# Altium schematic sheet [12]-WIFI Module WF60.SchDoc: RK3399 SOM Board Design V1.0
size A4; Author: AVIRAL MISHRA; DocumentNumber: 14; SheetNumber: 14; SheetTotal: 21; PROJECT CODE: A_V1.0
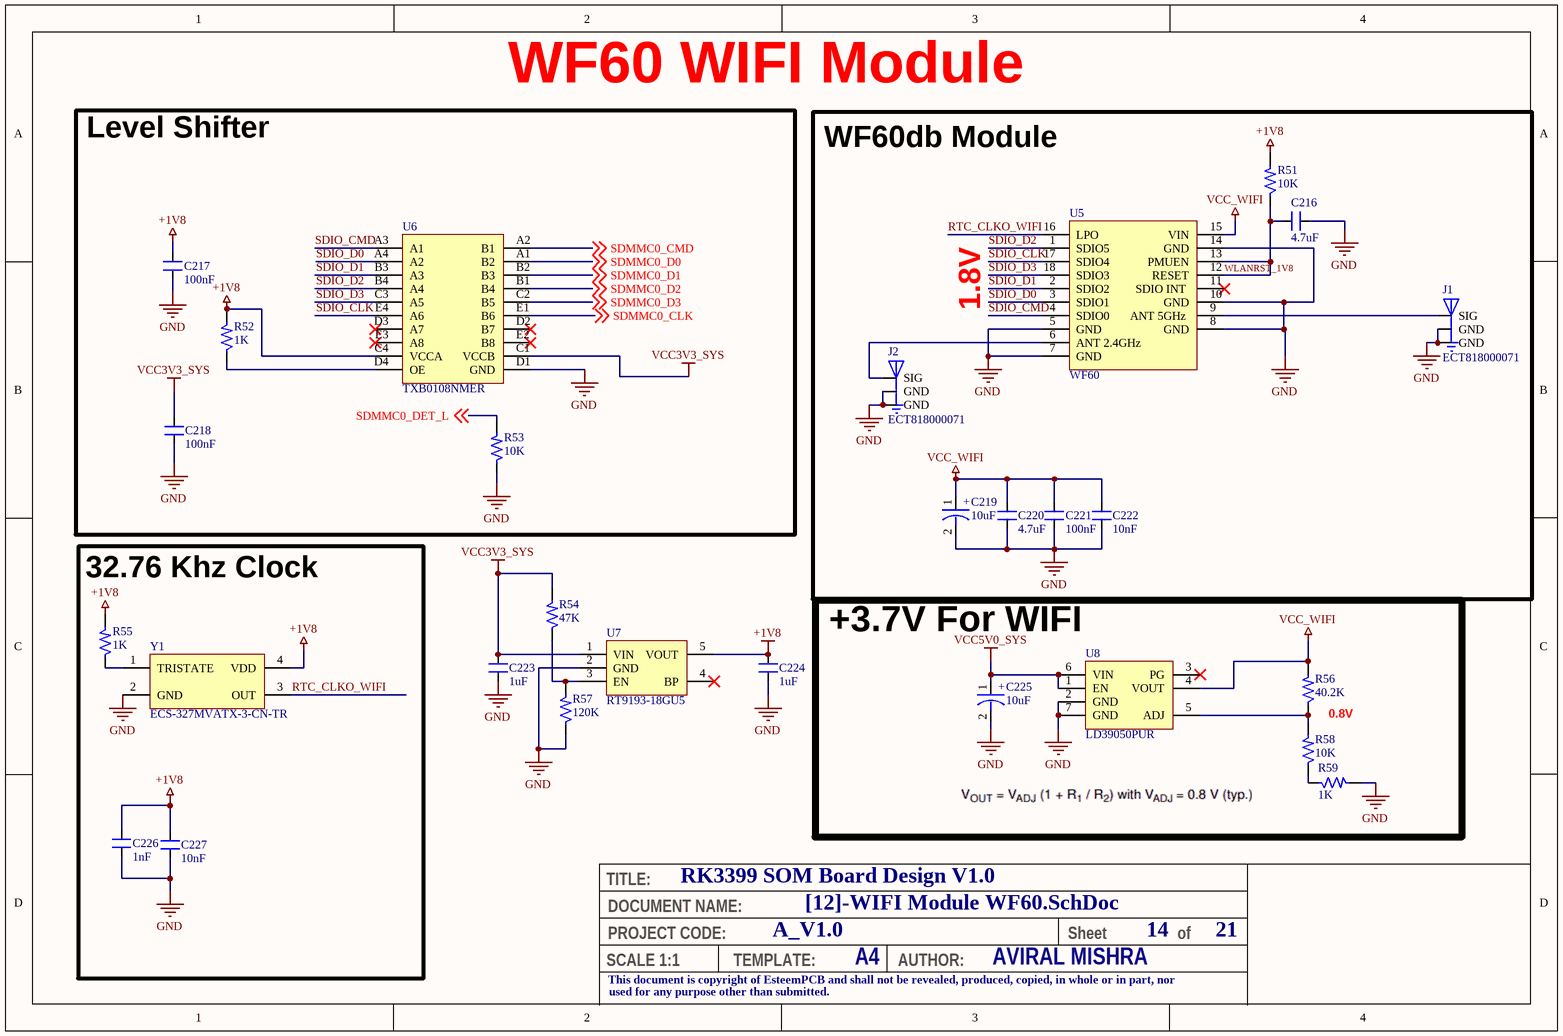
[diagram p0: [12]-WIFI Module WF60.SchDoc]

## Parts
C216  4.7uF  [CAP_0402]
C217  100nF  [CAP_0402]
C218  100nF  [CAP_0402]
C219  10uF  [CAP-T_1206]
C220  4.7uF  [CAP_0402]
C221  100nF  [CAP_0402]
C222  10nF  [CAP_0402]
C223  1uF  [CAP_0402]
C224  1uF  [CAP_0402]
C225  10uF  [CAP-T_1206]
C226  1nF  [CAP_0402]
C227  10nF  [CAP_0402]
J1  ECT818000071  [CON3_UFL_116_SMD_ST]
J2  ECT818000071  [CON3_UFL_116_SMD_ST]
R51  10K  [RES_0402]
R52  1K  [RES_0402]
R53  10K  [RES_0402]
R54  47K  [RES_0402]
R55  1K  [RES_0402]
R56  40.2K  [RES_0805]
R57  120K  [RES_0402]
R58  10K  [RES_0402]
R59  1K  [RES_0402]
U5  WF60  [MOD_WF60]
U6  TXB0108NMER  [NFBGA_31.4_125.9X102.36]
U7  RT9193-18GU5  [SC70-5]
U8  LD39050PUR  [DFN-6_37.4_165_33X15_SMD]
Y1  ECS-327MVATX-3-CN-TR  [XTAL_57_35X31_SMD]

## Blocks framed on the sheet
WF60 WIFI Module: C217 C218 R52 R53 U6
32.76 Khz Clock: C226 C227 R55 Y1
+3.7V For WIFI: C225 R56 R58 R59 U8

## Nets
+1V8: C217.2 C224.2 C226.2 C227.2 R51.2 R52.2 R55.2 U6.C4(VCCA) U7.5(VOUT) Y1.4(VDD)
GND: C216.1 C217.1 C218.1 C219.2 C220.1 C221.1 C222.1 C223.1 C224.1 C225.2 C226.1 C227.1 J1.1(GND) J1.3(GND) J2.1(GND) J2.3(GND) R53.1 R57.1 R59.2 U5.5(GND) U5.7(GND) U5.8(GND) U5.10(GND) U5.14(GND) U6.D1(GND) U7.2(GND) U8.2(GND) U8.7(GND) Y1.2(GND)
VCC3V3_SYS: C218.2 C223.2 R54.2 U6.C1(VCCB) U7.1(VIN)
VCC5V0_SYS: C225.1 U8.1(EN) U8.6(VIN)
VCC_WIFI: C219.1 C220.2 C221.2 C222.2 R56.2 U5.15(VIN) U8.4(VOUT)
RTC_CLKO_WIFI: U5.16(LPO) Y1.3(OUT)
SDIO_CLK: U5.17(SDIO4) U6.E4(A6)
SDIO_CMD: U5.4(SDIO0) U6.A3(A1)
SDIO_D0: U5.3(SDIO1) U6.A4(A2)
SDIO_D1: U5.2(SDIO2) U6.B3(A3)
SDIO_D2: U5.1(SDIO5) U6.B4(A4)
SDIO_D3: U5.18(SDIO3) U6.C3(A5)
SDMMC0_CLK: U6.E1(B6) ; off-sheet SDMMC0_CLK
SDMMC0_CMD: U6.A2(B1) ; off-sheet SDMMC0_CMD
SDMMC0_D0: U6.A1(B2) ; off-sheet SDMMC0_D0
SDMMC0_D1: U6.B2(B3) ; off-sheet SDMMC0_D1
SDMMC0_D2: U6.B1(B4) ; off-sheet SDMMC0_D2
SDMMC0_D3: U6.C2(B5) ; off-sheet SDMMC0_D3
SDMMC0_DET_L: R53.2 ; off-sheet SDMMC0_DET_L
WLANRST_1V8: C216.2 R51.1 U5.12(RESET) U5.13(PMUEN)
NetJ1_2: J1.2(SIG) U5.9(ANT_5GHz)
NetJ2_2: J2.2(SIG) U5.6(ANT_2.4GHz)
NetR52_1: R52.1 U6.D4(OE)
NetR54_1: R54.1 R57.2 U7.3(EN)
NetR55_1: R55.1 Y1.1(TRISTATE)
NetR56_1: R56.1 R58.2 U8.5(ADJ)
NetR58_1: R58.1 R59.1

Not connected (* = marked no-connect by the designer): U5 11(SDIO_INT_)*; U6 D2(B7)* D3(A7)* E2(B8)* E3(A8)*; U7 4(BP)*; U8 3(PG)*

## Notes on the sheet
- Level Shifter
- WF60db Module
- 1.8V
- 0.8V
- TITLE:
- DOCUMENT NAME:
- SCALE 1:1
- This document is copyright of EsteemPCB and shall not be revealed, produced, copied, in whole or in part, nor
- PROJECT CODE:
- TEMPLATE:
- A4
- AUTHOR:
- Sheet
- of
- used for any purpose other than submitted.
- (in symbol CAP-P_10uF-16V-10%-1206) +

## Library data of the parts
C216 C220 = CAP_4.7uF-10V-10%-0402: 4.7µF ±10% 10V Ceramic Capacitor X5R 0402 (1005 Metric) /; Manufacturer: Samsung Electro-Mechanics; Manufacturer Part Number: CL05A475KP5NRNC; Case/Package: 0402; Supplier-1: Digikey
C217 C218 C221 = CAP_100nF-25V-10%-0402: 0.1µF ±10% 25V Ceramic Capacitor X7R 0402 (1005 Metric) /; Manufacturer: Walsin Technology Corporation; Manufacturer Part Number: 0402B104K250CT; Case/Package: 0402; Supplier-1: Digikey
C219 C225 = CAP-P_10uF-16V-10%-1206: 10µF Molded Tantalum Capacitors 16V 1206 (3216 Metric) 3Ohm /; Manufacturer: AVX Corporation; Manufacturer Part Number: TAJA106K016SNJ; Nymble Part Number: 1EA-AA-0003; Alternate Part Number-1: CA45-A016K106T; Case/Package: 1206; Supplier-1: SIRICOM; Supplier Part Number-1: TAJA106K016SNJ; Category: Capacitor; Number of Pins: 2
C222 C227 = CAP_10nF-10V-10%-0402: 10000pF ±10% 10V Ceramic Capacitor X7R 0402 (1005 Metric) /; Manufacturer: AVX Corporation; Manufacturer Part Number: 0402ZC103KAT2A; Case/Package: 0402; Supplier-1: Digikey
C223 C224 = CAP_1uF-16V-10%-0402: 1µF ±10% 16V Ceramic Capacitor X5R 0402 (1005 Metric) /; Manufacturer: Knowles Novacap; Manufacturer Part Number: 0402BW105K160YT; Case/Package: 0402; Supplier-1: Digikey
C226 = CAP_1nF-16V-10%-0402: 1000pF ±10% 16V Ceramic Capacitor X7R 0402 (1005 Metric) /; Manufacturer: Yageo; Manufacturer Part Number: CC0402KRX7R7BB102; Case/Package: 0402; Supplier-1: Digikey
J1 J2 = CON-PLG_3X1-ECT818000071-ST-SMD: SMD RF Connectors/Coaxial Connectors RoHS; Manufacturer: ECT; Manufacturer Part Number: ECT818000071; Case/Package: SMD; Supplier-1: LCSC
R51 R53 R58 = RES_10K-0.1W-1%-0402: 10 kOhms ±1% 0.1W, 1/10W Chip Resistor 0402 (1005 Metric) Anti-Sulfur Thin Film /; Manufacturer: Vishay Beyschlag/Draloric/BC Components; Manufacturer Part Number: MCS04020C1002FE000; Case/Package: 0402; Supplier-1: Digikey
R52 R55 R59 = RES_1K-0.1W-1%-0402: 1 kOhms ±1% 0.1W, 1/10W Chip Resistor 0402 (1005 Metric) Anti-Sulfur Thin Film /; Manufacturer: Vishay Beyschlag/Draloric/BC Components; Manufacturer Part Number: MCS04020C1001FE000; Case/Package: 0402; Supplier-1: Digikey
R54 = RES_47K-0.1W-1%-0402: 47 kOhms ±1% 0.1W, 1/10W Chip Resistor 0402 (1005 Metric) Automotive AEC-Q200 Thick Film /; Manufacturer: Panasonic Electronic Components; Manufacturer Part Number: ERJ-2RKF4702X; Case/Package: 0402; Supplier-1: Digikey
R56 = RES_40.2K-0.125W-1%-0805: 40.2 kOhms ±1% 0.125W, 1/8W Chip Resistor 0805 (2012 Metric) Automotive AEC-Q200 Thick Film /; Manufacturer: TE Connectivity; Manufacturer Part Number: RMCF0805FT40K2; Nymble Part Number: 1EA-AA-0396; Alternate Part Number-1: NA; Case/Package: 0805; Supplier-1: SIRICOM; Supplier Part Number-1: WR08X4022FTL; Category: Resistor; Number of Pins: 2
R57 = RES_120K-0.1W-1%-0402: 120 kOhms ±1% 0.1W, 1/10W Chip Resistor 0402 (1005 Metric) Anti-Sulfur Thin Film /; Manufacturer: Vishay Beyschlag/Draloric/BC Components; Manufacturer Part Number: MCS04020C1203FE000; Case/Package: 0402; Supplier-1: Digikey
U5 = MOD_WF60-SMD: Amp’ed RF Tech presents the WF60 WiFi dual / band module: 802.11abgn.; Nymble Part Number: 1EA-AA-0568; Alternate Part Number-1: NA; Manufacturer: Amp’ed; Manufacturer Part Number: WF60; Case/Package: SMD; Supplier-1: Arrow; Supplier Part Number-1: WF60; Category: Module; Number of Pins: 16
U6 = IC_TXB0108NMER: Translation - Voltage Levels 8-Bit Bidirectional Voltage-Level Shifter with Auto Direction Sensing and +/-15-kV ESD Protect; Manufacturer: Texas Instruments; Manufacturer Part Number: TXB0108NMER; Case/Package: NFBGA-20; Supplier-1: Mouser
U7 = REG_1.8V-300mA-5.5V-SC70-5: Linear Voltage Regulator IC 1 Output 300mA SC-70-5; Manufacturer: Richtek USA Inc.; Manufacturer Part Number: RT9193-18GU5; Case/Package: SC70-5; Supplier-1: Digikey
U8 = REG_5.5V-0~5.1V-0.5A-2.55W-DFN-6: Adjustable 5.5V 0.8V 500mA DFN-6 Linear Voltage Regulators RoHS; Manufacturer: STMicroelectronics; Nymble Part Number: 1EA-AA-0572; Alternate Part Number-1: NA; Manufacturer Part Number: LD39050PUR; Case/Package: DFN-6; Supplier-1: LCSC; Supplier Part Number-1: C222094; Category: Regulators; Number of Pins: 6
Y1 = XTAL_ECS-327MVATX-2-CN-TR: 32.768kHz XO (Standard) CMOS Oscillator 1.6V ~ 3.6V Enable/Disable 4-SMD, No Lead; Manufacturer: ECS INC; Nymble Part Number: 1EA-AA-0561; Alternate Part Number-1: NA; Manufacturer Part Number: ECS-327MVATX-3-CN-TR; Case/Package: SMD-4; Supplier-1: Digikey; Supplier Part Number-1: ECS-327MVATX-3-CN-TR; Category: Crystal; Number of Pins: 4